# Altium schematic sheet H17R0_Frontend 1.SchDoc: H17R0
size Letter; CompanyName: Hexabitz; DocumentNumber: 2; Revision: 1; SheetNumber: 2; SheetTotal: 3
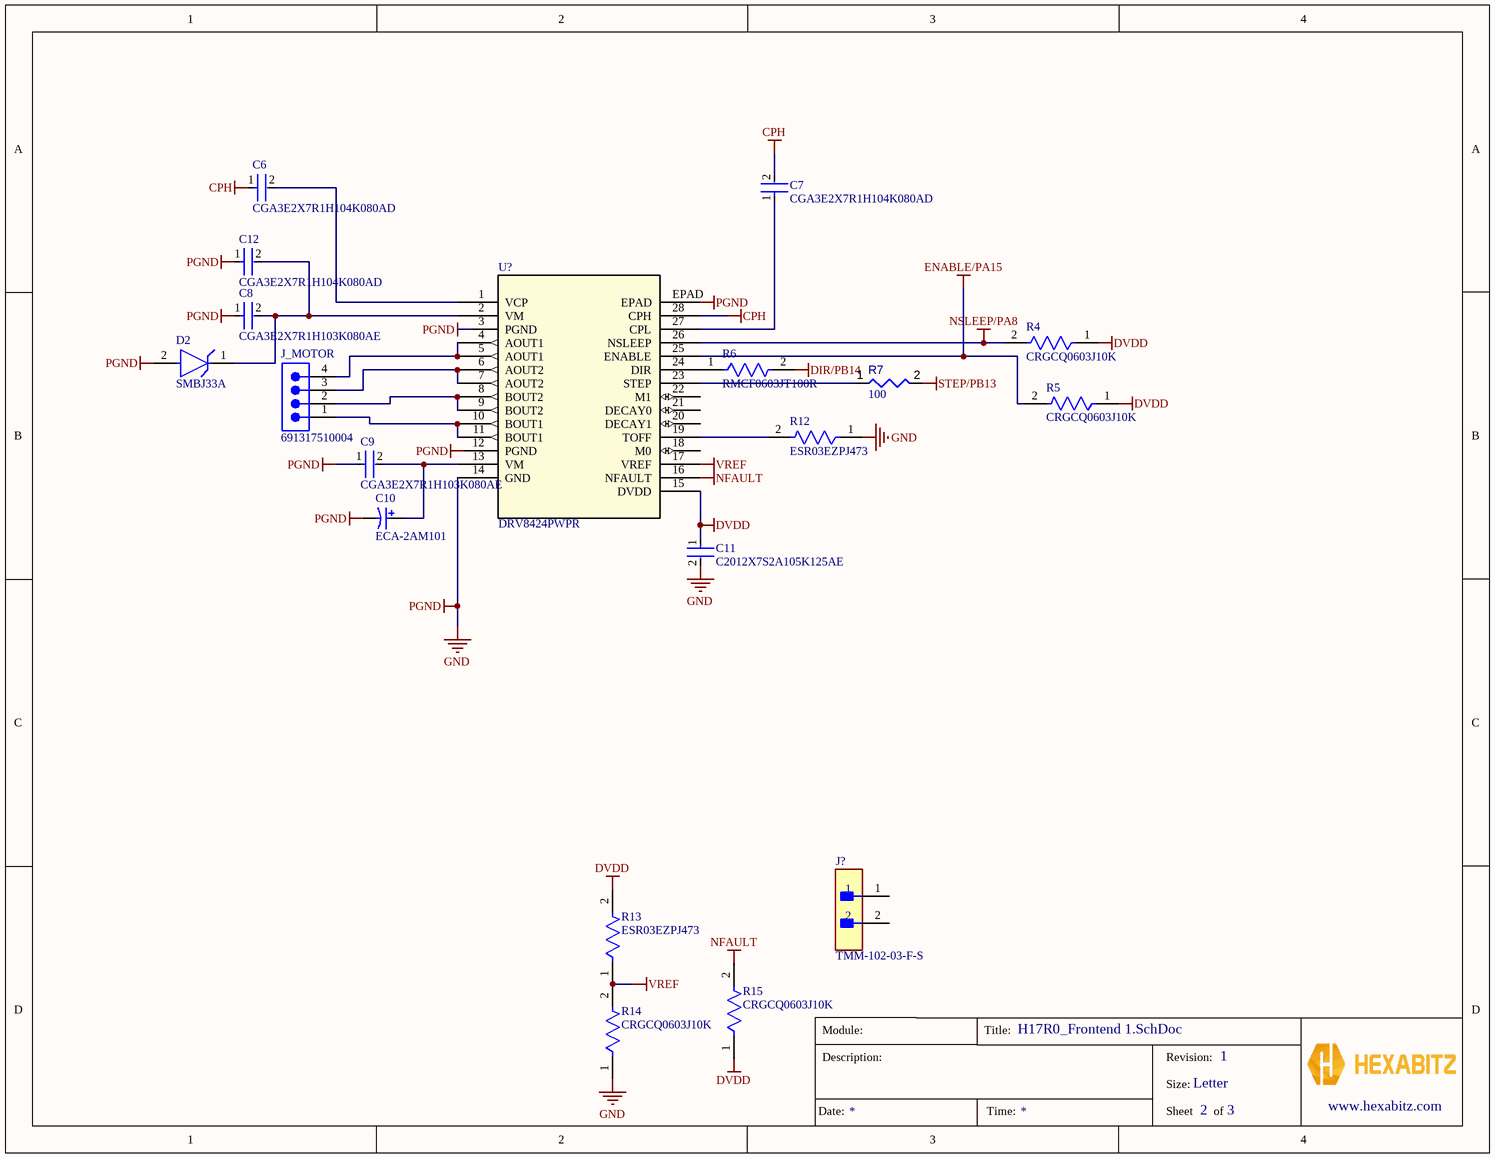
[diagram p0: H17R0_Frontend 1.SchDoc]

## Parts
C6  CGA3E2X7R1H104K080AD  [FP-CGA3E-0_3-0_1-MFG]
C7  CGA3E2X7R1H104K080AD  [FP-CGA3E-0_3-0_1-MFG]
C8  CGA3E2X7R1H103K080AE  [FP-CGA3E-0_3-0_1-IPC_B]
C9  CGA3E2X7R1H103K080AE  [FP-CGA3E-0_3-0_1-IPC_B]
C10  ECA-2AM101  [CAPPR65-500-1600X1000X1700]
C11  C2012X7S2A105K125AE  [FP-C2012-125-IPC_B]
C12  CGA3E2X7R1H104K080AD  [FP-CGA3E-0_3-0_1-MFG]
D2  SMBJ33A  [FP-SMBJ-MFG]
J?  TMM-102-03-F-S  [FP-TMM-102-03-F-S-MFG]
J_MOTOR  691317510004  [691317510004]
R4  CRGCQ0603J10K  [FP-CRGCQ0603-IPC_C]
R5  CRGCQ0603J10K  [FP-CRGCQ0603-IPC_C]
R6  RMCF0603JT100R  [FP-RMCF0603-IPC_A]
R7  value 100  [RESC0402(1005)_L]  (hidden comment: Resistor 100R +/-1 % 0402 63 mW)
R12  ESR03EZPJ473  [FP-ESR03-IPC_C]
R13  ESR03EZPJ473  [FP-ESR03-IPC_C]
R14  CRGCQ0603J10K  [FP-CRGCQ0603-IPC_C]
R15  CRGCQ0603J10K  [FP-CRGCQ0603-IPC_C]
U?  DRV8424PWPR  [SOIC_24PWPR_TEX]

## Nets
CPH: C6.1 C7.2 U?.28(CPH)
DIR/PB14: R6.2
DVDD: C11.1 R4.1 R5.1 R13.2 R15.1 U?.15(DVDD)
ENABLE/PA15: R5.2 U?.25(ENABLE)
GND: C8.1 C9.1 C10.2 C11.2 C12.1 D2.2(A) R12.1 R14.1 U?.3(PGND) U?.14(GND) U?.EPAD  [also labelled PGND]
NFAULT: R15.2 U?.16(NFAULT)
NSLEEP/PA8: R4.2 U?.26(NSLEEP)
STEP/PB13: R7.2
VREF: R13.1 R14.2 U?.17(VREF)
NetC6_2: C6.2 U?.1(VCP)
NetC7_1: C7.1 U?.27(CPL)
NetC8_2: C8.2 C12.2 D2.1(C) U?.2(VM)
NetC9_2: C9.2 C10.1 U?.13(VM)
NetJ_MOTOR_1: J_MOTOR.1 U?.10(BOUT1) U?.11(BOUT1)
NetJ_MOTOR_2: J_MOTOR.2 U?.8(BOUT2) U?.9(BOUT2)
NetJ_MOTOR_3: J_MOTOR.3 U?.6(AOUT2) U?.7(AOUT2)
NetJ_MOTOR_4: J_MOTOR.4 U?.4(AOUT1) U?.5(AOUT1)
NetR6_1: R6.1 U?.24(DIR)
NetR7_1: R7.1 U?.23(STEP)
NetR12_2: R12.2 U?.19(TOFF)

Not connected (* = marked no-connect by the designer): J? 1 2; U? 12(PGND) 18(M0) 20(DECAY1) 21(DECAY0) 22(M1)

## Notes on the sheet
- Labels drawn without touching a wire or pin: PGND
- Module:
- Title:
- Description:
- Size:
- Revision:
- Letter
- www.hexabitz.com
- Date:
- Time:
- Sheet
- of

## Library data of the parts
C6 C7 C12 = CMP-08246-001259-1: Cap Ceramic 100nF 50V X7R 10% Pad SMD 0603 +125°C Automotive T/R; Weight: 7.1E-05oz; Case Code (Imperial): 0603; Min Operating Temperature: -55°C; Packaging: Tape and Reel; Dielectric: X7R; Tolerance: 10%; Case Code (Metric): 1608; Max Operating Temperature: 125°C; Composition: Ceramic; Capacitance: 100nF; Termination: SMD/SMT; Length: 1.6mm; Height: 0.8mm; Case/Package: 0603; Thickness: 0.035inch; Mount: Surface Mount; Voltage Rating (DC): 50V; Width: 0.8mm; Ratings: AEC-Q200; Voltage Rating: 50V; Depth: 0.8mm; Package Quantity: 4000
C8 C9 = CMP-08246-000510-1: Cap Ceramic 10nF 50V X7R 10% Pad SMD 0603 +125°C Automotive T/R; Termination: SMD/SMT; Min Operating Temperature: -55°C; Weight: 7.1E-05oz; Capacitance: 10nF; Mount: Surface Mount; Package Quantity: 4000; Max Operating Temperature: 125°C; Voltage Rating: 50V; Tolerance: 10%; Packaging: Tape and Reel; Height: 0.8mm; Length: 0.063inch; Features: Soft Termination; Voltage Rating (DC): 50V; Case/Package: 0603; Thickness: 0.035inch; Ratings: AEC-Q200; Case Code (Imperial): 0603; Width: 0.031inch; Dielectric: X7R; Case Code (Metric): 1608
C10 = CMP-1665-00044-1: Aluminum Electrolytic Capacitor, 100 uF, +/- 20%, 100 V, -40 to 85 degC, 2-Pin THD, RoHS, Bulk; Power Rating: 250 mW; Tolerance: 1%; Resistance: 100 Ohm; Type (Resistor): Carbon Film; Voltage Rating: 250 V; Case\Package: Axial; RoHSCompliant: true; Max Operating Temperature: 155 degC; DatasheetVersion: Mar-16; PackageDescription: 2-Pin Through Hole Device, Dia 10 mm, Body Length 16 mm; ComponentLink1Description: Manufacturer URL; Package Quantity: 200; Mount: Through Hole; ComponentLink2URL: https://industrial.panasonic.com/cdbs/www-data/pdf/RDF0000/ABA0000C1047.pdf; Packaging: Bulk; Length: 0.248 inch; PackageReference: CAPPR65-500-1600X1000X1700; ComponentLink2Description: Datasheet; Min Operating Temperature: -55 degC; ComponentLink1URL: http://www.panasonic.com/
C11 = CMP-08246-004333-1: CAP CER 1UF 100V X7S 0805; Tolerance: 10%; Case Code (Metric): 2012; Resistor Type: Ceramic; Voltage Rating (DC): 100V; RoHS Compliant: Yes; Mount: Surface Mount; Min Operating Temperature: -55°C; Voltage Rating: 100V; Series: C; Width: 0.05inch; Max Operating Temperature: 125°C; Height: 1.25mm; Capacitance: 1uF; Length: 2mm; Dielectric: X7S; Case/Package: 0805; Packaging: Tape and Reel; Features: Soft Termination; Lead Free: Lead Free; Case Code (Imperial): 0805; Thickness: 0.049inch; Termination: SMD/SMT; Package Quantity: 1; Depth: 1.25mm
D2 = CMP-2000-07095-2: TVS DIODE 33V 53.3V DO214AA; Manufacturer: Littelfuse Inc; Max Junction Temp: +150°C; Number Of Channels: 1; Breakdown Voltage: 36.7V; Peak Pulse Power: 600W; Direction: Unidirectional; Peak Pulse Current: 11.3A; Lead Free: Yes; Height: 2.61mm; Temperature Range Low: -65°C; ComponentLink2URL: https://www.littelfuse.com/~/media/electronics/datasheets/tvs_diodes/littelfuse_tvs_diode_smbj_datasheet.pdf.pdf; Manufacturer Part Number: SMBJ33A; Clamping Voltage: 53.3V; Device Class L1: Circuit Protection; Octopart: https://octopart.com/smbj33a-littelfuse-350829; Device Class L2: TVS Diodes; Digikey Description: TVS DIODE 33V 53.3V DO214AA; Automotive: No; Temperature Range High: +150°C; Package: SMBJ; ComponentLink2Description: Datasheet; Mouser Description: TVS DIODE 33V 53.3V DO214AA; Reverse Standoff Voltage: 33V; Category: Diode; Device Class L3: unset; Temperature: -65°C to +150°C; RoHS: TRUE
J? = CMP-02766-001614-1: CONN HEADER VERT 2POS 2MM; Number of Contacts: 2; Gender: Male; Pitch: 2mm; Packaging: Bulk; RoHS Compliant: Yes; Termination: Solder; Contact Plating: Gold; Mount: Through Hole; Number of Rows: 1; Radiation Hardening: No; Lead Free: Lead Free
J_MOTOR = CMP-03913-90321403-1: 691317510004 Terminal block, 5.08mm pitch, close horizontal PCB header, flanges, 4 Pins; Gender: Male; Lead Pitch: 5.08mm; NexarPartId: 90321403; Number of Pins: 4; Packaging: Box
R4 R5 R14 R15 = CMP-03211-009884-1: CRGCQ 0603 10K 5%; Manufacturer: TE Connectivity; Tolerance: 0.05; Power Rating: 0.1W; Resistance: 10KΩ; Voltage Rating: 75V; Value: 10KΩ; Temperature Coefficient: ±100ppm/°C; Composition: Thick Film; ComponentLink2URL: https://www.te.com/commerce/DocumentDelivery/DDEController?Action=showdoc&DocId=Data+Sheet%7F1773204-3%7F1%7Fpdf%7FEnglish%7FENG_DS_1773204-3_1.pdf%7F4-2176339-923; Device Class L1: Passive Components; Package: CRGCQ0603; Mouser Description: Res Thick Film 0603 10K Ohm 5% 0.1W(1/10W) ±100ppm/C Pad SMD Automotive T/R; Temperature Range High: +155°C; Category: Res; Device Class L2: Resistors; Height: 0.55mm; RoHS: TRUE; Lead Free: Yes; Ipc Land Pattern Name: RESC16080X45; Temperature: -55°C to +155°C; Series: CRGCQ; Digikey Description: CRGCQ 0603 10K 5%; Octopart: https://octopart.com/crgcq0603j10k-te+connectivity-91018097; Device Class L3: Chip SMD Resistors; Ambient Temperature Range High: +70°C; ComponentLink2Description: Datasheet; Temperature Range Low: -55°C; Manufacturer Part Number: CRGCQ0603J10K
R6 = CMP-26527-004540-1: 100Ω ±5% 0.1W 0603 Thick Film Chip Resistor AEC-Q200 compliant; Resistance: 100R; Power Rating: 100mW; Temperature Coefficient: 100ppm/°C; Case Code (Imperial): 0603; Min Operating Temperature: -55°C; RoHS Compliant: Yes; Size Code: 0603; Radiation Hardening: No; Construction: Rectangular; Resistor Type: Thick Film; Max Operating Temperature: 155°C; Packaging: Tape and Reel; Height: 0.022inch; Military Standard: Not; Case Code (Metric): 1608; Max Power Dissipation: 100mW; Contact Plating: Tin; Features: Automotive AEC-Q200; Number of Terminations: 2; Mount: Surface Mount; Length: 1.55mm; Width: 0.031inch; Tolerance: 5%; Depth: 0.8mm; Lead Free: Lead Free; Series: RMCF; Case/Package: 0603
R7 = CMP-009-00167-3: Chip Resistor, 100 Ohms, +/-1 %, 63 mW, -55 to 155 degC, 0402; Power: 63mW; Tolerance: 1%; Min Operating Temperature: -55°C; Case/Package: 0402; Pins: 2; Max Operating Temperature: 155°C
R12 R13 = CMP-08839-028279-1: 47kΩ ±5% 0.25W 0603 Anti-Surge Chip Resistor AEC-Q200; Resistance: 47kR; Max Power Dissipation: 250mW; Temperature Coefficient: 200ppm/°C; Series: ESR; Number of Terminations: 2; Min Operating Temperature: -55°C; Features: Automotive AEC-Q200; Width: 0.031inch; Case Code (Imperial): 0603; Case/Package: 0603; Packaging: Tape and Reel; Resistor Type: Thick Film; Length: 0.063inch; Tolerance: 5%; Package Quantity: 1; Max Operating Temperature: 155°C; Height: 0.022inch; Case Code (Metric): 1608; RoHS Compliant: Yes
U? = DRV8424PWPR: 35-V, 2.5-A bipolar stepper driver with integrated current sensing & 1/256 microstepping 28-HTSSOP -40 to 125; Manufacturer_Name: Texas Instruments; Copyright: Copyright (C) 2025 Ultra Librarian. All rights reserved.; Manufacturer_Part_Number: DRV8424PWPR; Datasheet: https://www.ti.com/lit/gpn/drv8424; RefDes: RefDes; Type: Type